# EAGLE design gondola (EAGLE 8.3.2)
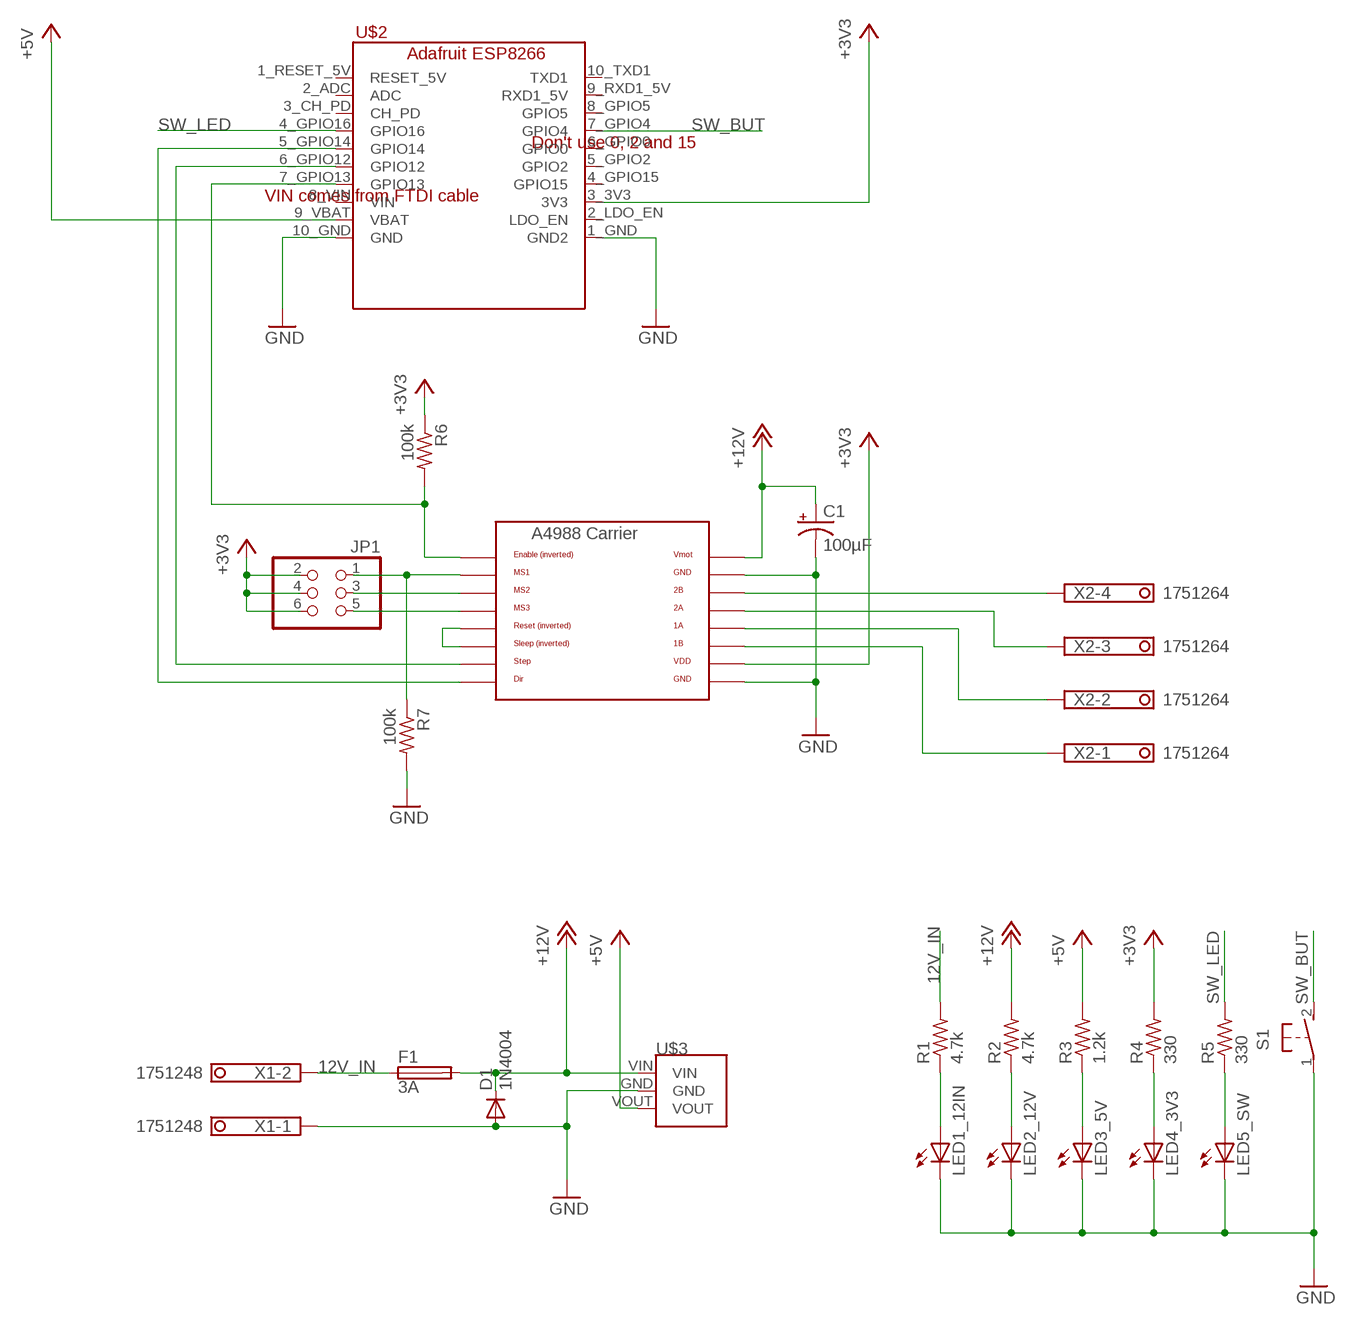
[diagram p0: schematic, sheet 1]

## Parts
C1  100µF  CPOL-US153CLV-0605  [153CLV-0605]
D1  1N4004  [DO41-10]
F1  3A  PTCFUSE  [LITTLEFUSE]
JP1  PINHD-2X3  [2X03]
LED1_12IN  LEDCHIP-LED0805  [CHIP-LED0805]
LED2_12V  LEDCHIP-LED0805  [CHIP-LED0805]
LED3_5V  LEDCHIP-LED0805  [CHIP-LED0805]
LED4_3V3  LEDCHIP-LED0805  [CHIP-LED0805]
LED5_SW  LEDCHIP-LED0805  [CHIP-LED0805]
R1  4.7k  R-US_R0805  [R0805]
R2  4.7k  R-US_R0805  [R0805]
R3  1.2k  R-US_R0805  [R0805]
R4  330  R-US_R0805  [R0805]
R5  330  R-US_R0805  [R0805]
R6  100k  R-US_R0805  [R0805]
R7  100k  R-US_R0805  [R0805]
S1  31-XX  [B3F-31XX]
U$1  A4988BREAKOUT  [A4988BREAKOUT]
U$2  ADAFRUIT_ESP8266  [ADAFRUIT_ESP8266]
U$3  ROHM_BP5293-XX  [ROHM_BP5293-XX]
X1  1751248  [1751248]
X2  1751264  [1751264]

## Nets
1A: U$1.1A X2.2
1B: U$1.1B X2.1
2A: U$1.2A X2.3
2B: U$1.2B X2.4
12V_IN: F1.1 R1.2 X1.2
!RESET: U$1.RST U$1.SLP(SLEEP)
+3V3: JP1.2 JP1.4 JP1.6 R4.2 R6.1 U$1.VDD U$2.3_3V3(3V3)
+5V: R3.2 U$2.9_VBAT(VBAT) U$3.VOUT
+12V: C1.+ D1.C F1.2 R2.2 U$1.VMOT U$3.VIN
DIR: U$1.DIR U$2.5_GPIO14(GPIO14)
GND: C1.- D1.A LED1_12IN.C LED2_12V.C LED3_5V.C LED4_3V3.C LED5_SW.C R7.2 S1.1(P) U$1.GND U$1.GND@0(GND) U$2.1_GND(GND2) U$2.10_GND(GND) U$3.GND X1.1
M_EN: R6.2 U$1.EN U$2.7_GPIO13(GPIO13)
MS1: JP1.1 R7.1 U$1.MS1
MS2: JP1.3 U$1.MS2
MS3: JP1.5 U$1.MS3
N$1: LED2_12V.A R2.1
N$2: LED1_12IN.A R1.1
N$8: LED4_3V3.A R4.1
N$18: LED5_SW.A R5.1
N$19: LED3_5V.A R3.1
STEP: U$1.STEP U$2.6_GPIO12(GPIO12)
SW_BUT: S1.2(S) U$2.7_GPIO4(GPIO4)
SW_LED: R5.2 U$2.4_GPIO16(GPIO16)
Unconnected: U$2.1_RESET_5V(RESET_5V) U$2.2_ADC(ADC) U$2.2_LDO_EN(LDO_EN) U$2.3_CH_PD(CH_PD) U$2.4_GPIO15(GPIO15) U$2.5_GPIO2(GPIO2) U$2.6_GPIO0(GPIO0) U$2.8_GPIO5(GPIO5) U$2.8_VIN(VIN) U$2.9_RXD1_5V(RXD1_5V) U$2.10_TXD1(TXD1)

## Notes on the sheet
- Don't use 0, 2 and 15
- VIN comes from FTDI cable

## Library data of the parts
C1 = adafruit:CPOL-US: POLARIZED CAPACITOR, American symbol
D1 = diode:1N4004: DIODE general purpose rectifier, 1 A
F1 = RepRapjr:PTCFUSE: LITTLEFUSE Picofuse/slow Littlefuse
JP1 = pinhead:PINHD-2X3: PIN HEADER
LED1_12IN LED2_12V LED3_5V LED4_3V3 LED5_SW = led:LED: LED OSRAM: - CHIPLED LG R971, LG N971, LY N971, LG Q971, LY Q971, LO R971, LY R971 LH N974, LH R974 LS Q976, LO Q976, LY Q976 LO Q996 - Hyper CHIPLED LW Q18S LB Q993, LB Q99A, LB R99A - SideLED LS A670, LO A670, LY A670, LG A670, LP A670 LB A673, LV A673, LT A673, LW A673 LH A674 LY A675 LS A676, LA A676, LO A676, LY A676, LW A676 LS A679, LY A679, LG A679 - Hyper Micro SIDELED® LS Y876, LA Y876, LO Y876, LY Y876 LT Y87S - SmartLED LW L88C, LW L88S LB L89C, LB L89S, LG L890 LS L89K, LO L89K, LY L89K LS L896, LA L896, LO L896, LY L896 - TOPLED LS T670, LO T670, LY T670, LG T670, LP T670 LSG T670, LSP T670, LSY T670, LOP T670, LYG T670 LG T671, LOG T671, LSG T671 LB T673, LV T673, LT T673, LW T673 LH T674 LS T676, LA T676, LO T676, LY T676, LB T676, LH T676, LSB T676, LW T676 LB T67C, LV T67C, LT T67C, LS T67K, LO T67K, LY T67K, LW E67C LS E67B, LA E67B, LO E67B, LY E67B, LB E67C, LV E67C, LT E67C LW T67C LS T679, LY T679, LG T679 LS T770, LO T770, LY T770, LG T770, LP T770 LB T773, LV T773, LT T773, LW T773 LH T774 LS E675, LA E675, LY E675, LS T675 LS T776, LA T776, LO T776, LY T776, LB T776 LHGB T686 LT T68C, LB T68C - Hyper Mini TOPLED® LB M676 - Mini TOPLED Santana® LG M470 LS M47K, LO M47K, LY M47K Source: http://www.osram.convergy.de LUXEON: - LUMILED® LXK2-PW12-R00, LXK2-PW12-S00, LXK2-PW14-U00, LXK2-PW14-V00 LXK2-PM12-R00, LXK2-PM12-S00, LXK2-PM14-U00 LXK2-PE12-Q00, LXK2-PE12-R00, LXK2-PE12-S00, LXK2-PE14-T00, LXK2-PE14-U00 LXK2-PB12-K00, LXK2-PB12-L00, LXK2-PB12-M00, LXK2-PB14-N00, LXK2-PB14-P00, LXK2-PB14-Q00 LXK2-PR12-L00, LXK2-PR12-M00, LXK2-PR14-Q00, LXK2-PR14-R00 LXK2-PD12-Q00, LXK2-PD12-R00, LXK2-PD12-S00 LXK2-PH12-R00, LXK2-PH12-S00 LXK2-PL12-P00, LXK2-PL12-Q00, LXK2-PL12-R00 Source: www.luxeon.com KINGBRIGHT: KA-3528ASYC Source: www.kingbright.com
R1-R7 = adafruit:R-US_: RESISTOR, American symbol
S1 = switch-omron:31-XX: OMRON SWITCH; MPN: B3F-3100; OC_FARNELL: 959704; OC_NEWARK: 36M3582
U$1 = RepRapjr:A4988BREAKOUT
U$2 = MS:ADAFRUIT_ESP8266
U$3 = MS:ROHM_BP5293-XX
X1 = con-phoenix-350:1751248: MKDS 1/ 2-3,5 Printklemme Nennstrom: 10 A Bemessungsspannung: 160 V Raster: 3,5 mm Polzahl: 2 Montageart: Löten Anschlussart: Schraubanschluss Anschlussrichtung vom Leiter zur Platine: 0° Source: http://eshop.phoenixcontact.com .. 1751248.pdf; OC_FARNELL: unknown; OC_NEWARK: unknown
X2 = con-phoenix-350:1751264: MKDS 1/ 4-3,5 Printklemme Nennstrom: 10 A Bemessungsspannung: 160 V Raster: 3,5 mm Polzahl: 4 Montageart: Löten Anschlussart: Schraubanschluss Anschlussrichtung vom Leiter zur Platine: 0° Source: http://eshop.phoenixcontact.com .. 1751264.pdf; MPN: 1751264; OC_FARNELL: unknown; OC_NEWARK: 10R0934

## Board
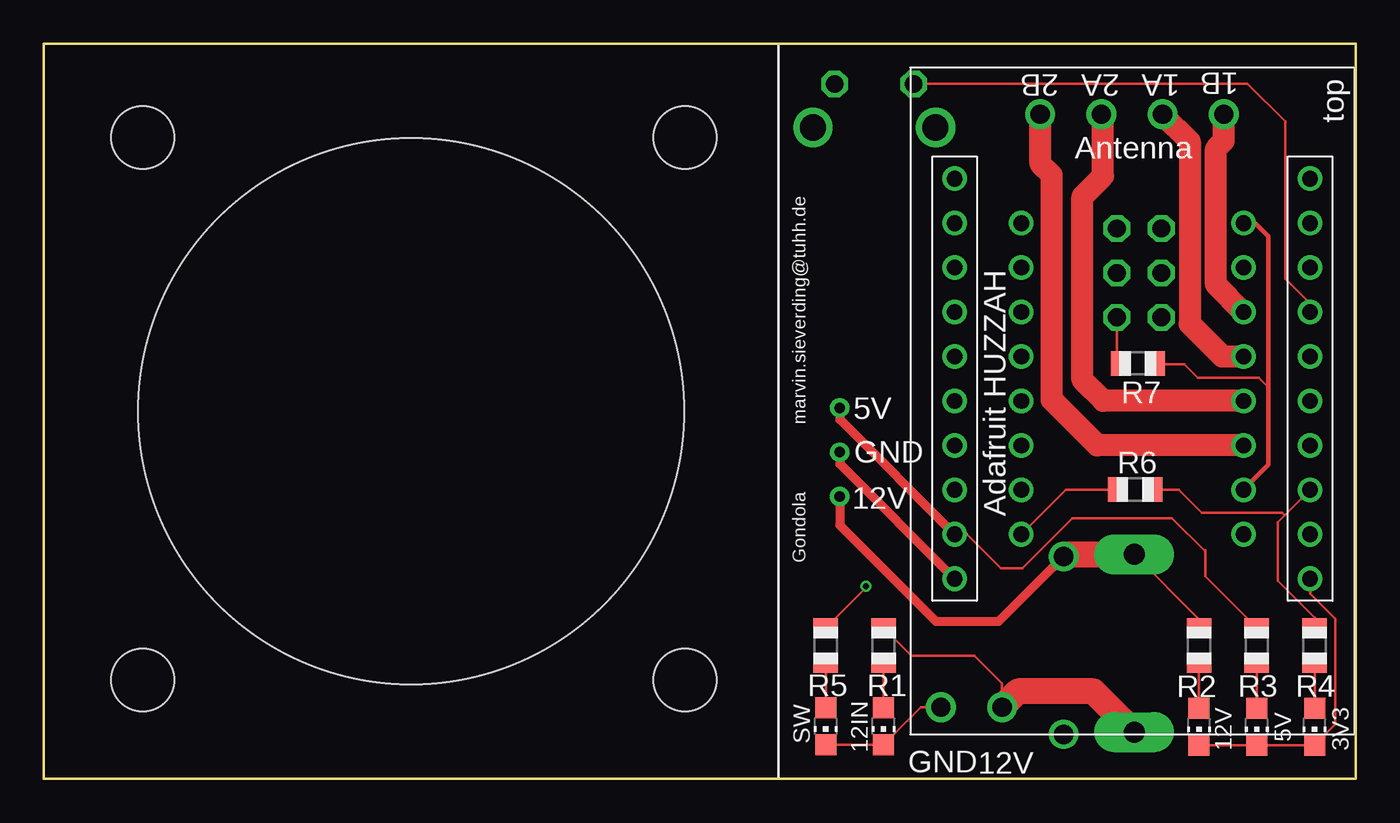
[diagram p1: board, top side]
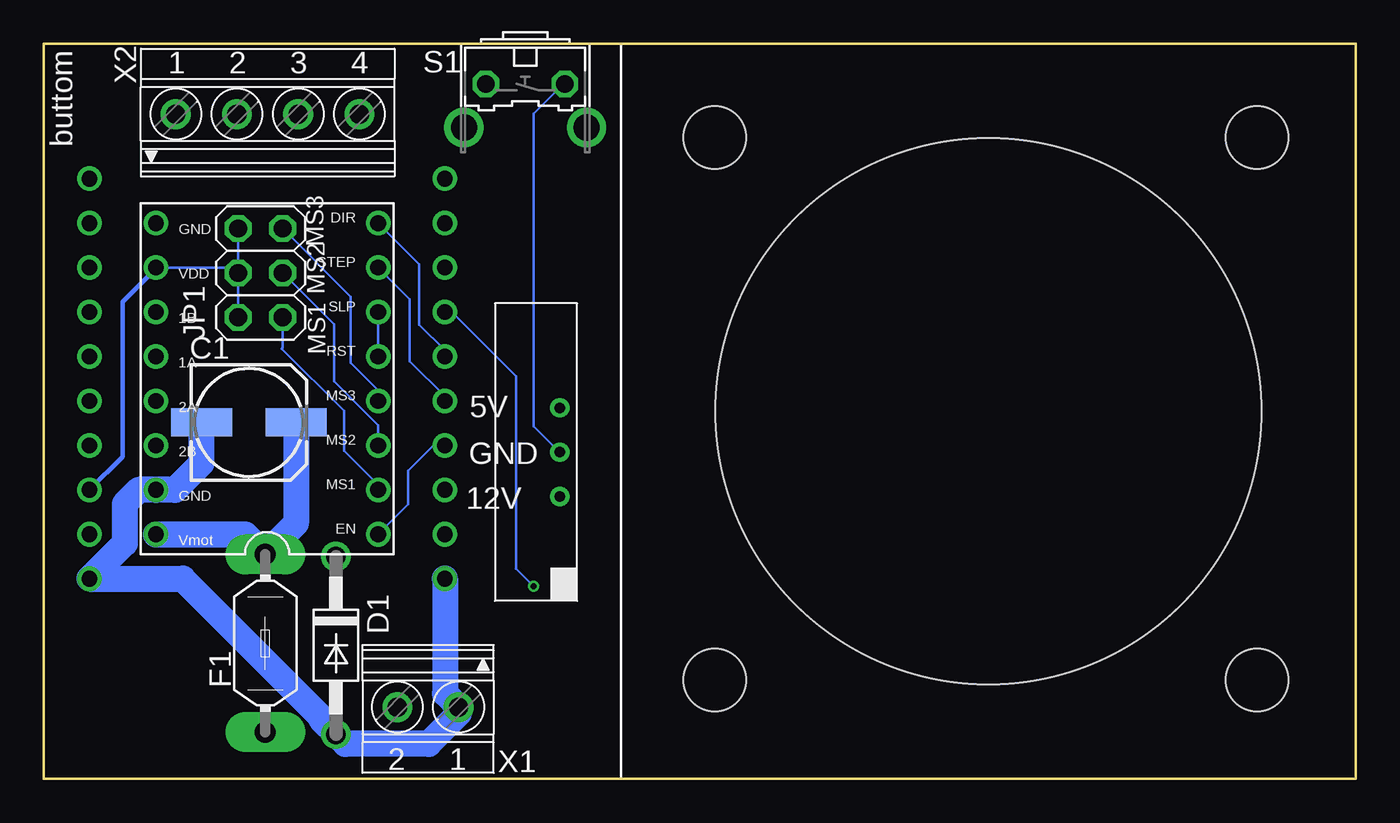
[diagram p2: board, bottom side, seen from below]

Size 75 x 42 mm. Coordinates in mm from the lower left corner, seen from the top.
Outline: 0,0 0,42 75,42 75,0 0,0
Copper layers (1*16): Top 0.035mm / dielectric 1.5mm / Bottom 0.035mm
Design rules "dirt_cheap_dirty_boards.v1": minimum track width 5mil, minimum drill 12mil, track to track 5mil, track to pad 5mil, pad to pad 5mil, via to via 5mil, smd to smd 0mil, copper to edge 10mil, drill to drill 10mil, minimum pad ring 10mil, minimum via ring 6mil, stop-mask expansion 2mil, vias tented up to drill 25mil, thermal gap 10mil
Holes 3.6 mm at 5.65,5.65 36.65,36.65 5.65,36.65 36.65,5.65
Holes 31.2 mm at 21,21

### Footprints (pad centres in the part's own frame; a part is rotated, then mirrored left to right if it is on the bottom)
153CLV-0605 = smd 3.5 x 1.6: + 2.7,0; - -2.7,0
DO41-10 = drill 1.118: A 5.08,0; C -5.08,0
LITTLEFUSE = drill 1.2 pad 2.3 long: 1 -5.08,0; 2 5.08,0
2X03 = drill 1.016 octagon: 1 -2.54,-1.27; 2 -2.54,1.27; 3 0,-1.27; 4 0,1.27; 5 2.54,-1.27; 6 2.54,1.27
CHIP-LED0805 = smd 1.2 x 1.2: A 0,-1.05; C 0,1.05
R0805 = smd 1.1 x 1.4: 1 -1,0; 2 1,0
B3F-31XX = drill 1.016 octagon: 1 -2.261,-1.245; 2 2.261,-1.245 | drill 1.499 pad 2.159: 3 -3.505,1.245; 4 3.505,1.245
A4988BREAKOUT = drill 0.9: 1A 8.89,1.27; 1B 11.43,1.27; 2A 6.35,1.27; 2B 3.81,1.27; DIR 16.51,-11.43; EN -1.27,-11.43; GND 16.51,1.27; GND@0 1.27,1.27; MS1 1.27,-11.43; MS2 3.81,-11.43; MS3 6.35,-11.43; RST 8.89,-11.43; SLP 11.43,-11.43; STEP 13.97,-11.43; VDD 13.97,1.27; VMOT -1.27,1.27
ADAFRUIT_ESP8266 = drill 0.9: 1_GND 22.86,8.89; 1_RESET_5V 2.54,31.75; 2_ADC 2.54,29.21; 2_LDO_EN 22.86,11.43; 3_3V3 22.86,13.97; 3_CH_PD 2.54,26.67; 4_GPIO15 22.86,16.51; 4_GPIO16 2.54,24.13; 5_GPIO2 22.86,19.05; 5_GPIO14 2.54,21.59; 6_GPIO0 22.86,21.59; 6_GPIO12 2.54,19.05; 7_GPIO4 22.86,24.13; 7_GPIO13 2.54,16.51; 8_GPIO5 22.86,26.67; 8_VIN 2.54,13.97; 9_RXD1_5V 22.86,29.21; 9_VBAT 2.54,11.43; 10_GND 2.54,8.89; 10_TXD1 22.86,31.75
ROHM_BP5293-XX = drill 0.6: GND 0,-2.54; VIN -2.54,-2.54; VOUT 2.54,-2.54
1751248 = drill 1.1 pad 1.7: 1 -1.75,-0.1; 2 1.75,-0.1
1751264 = drill 1.1 pad 1.7: 1 -5.25,-0.1; 2 -1.75,-0.1; 3 1.75,-0.1; 4 5.25,-0.1

### Placement (x,y rotation side)
C1  63.27,20.36 0 bottom
D1  58.29,7.62 270 bottom
F1  62.33,7.75 90 bottom
JP1  62.61,28.9 90 bottom
LED1_12IN  48.01,3 180 top
LED2_12V  66.04,2.97 180 top
LED3_5V  69.34,2.97 180 top
LED4_3V3  72.64,2.97 180 top
LED5_SW  44.7,3 180 top
R1  48.01,7.62 90 top
R2  66.04,7.62 90 top
R3  69.34,7.62 90 top
R4  72.64,7.62 90 top
R5  44.7,7.62 90 top
R6  62.39,16.53 180 top
R7  62.55,23.74 0 top
S1  47.47,38.46 180 bottom
U$1  67.31,15.24 90 bottom
U$2  49.53,2.54 0 top
U$3  48.05,18.66 90 bottom
X1  53.04,3.99 180 bottom
X2  62.2,38.07 0 bottom

### Tracks (layer width: path | path; a pad name or v marks a point on that pad's centre or on a via)
1A
  Top 1.27: X2.2 65.5,36.43 65.5,26 67.37,24.13 U$1.1A
1B
  Top 1.27: U$1.1B 67,28.25 67,36 67.45,36.45 X2.1
2A
  Top 0.152: 68.56,21.59 U$1.2A
  Top 1.27: U$1.2A 60.57,21.59 59.38,22.78 59.38,33.27 60.55,34.44 60.55,37.88 X2.3
2B
  Top 1.27: U$1.2B 60.22,19.05 57.62,21.65 57.62,34.49 56.98,35.13 56.98,37.95 X2.4
12V_IN
  Top 0.152: R1.2 49.59,7.04 53.21,7.04 54.78,5.46 X1.2
  Top 1.499: F1.1 60,5 55.7,5 X1.2
!RESET
  Bottom 0.152: U$1.RST U$1.SLP 55.88,27.08
+3V3
  Top 0.152: R4.2 72.64,9.2 70.54,11.3 70.54,14.66 70.94,15.06 | 70.94,15.06 U$2.3_3V3 | 70.94,15.06 70.8,15.2 66.2,15.2 64.87,16.53 R6.1
  Bottom 0.152: JP1.4 JP1.2 | JP1.6 JP1.4 | U$1.VDD 64.19,29.21 JP1.4
  Bottom 0.254: U$1.VDD 68.58,29.17 70.5,27.25 70.5,18.4 U$2.3_3V3
+5V
  Top 0.152: 66.4,13 66.4,13.06 | 66.4,13 66.4,11.57 R3.2 | U$2.9_VBAT 52.78,13.97 54.71,12.04 55.94,12.04 58.8,14.9 64.5,14.9 66.4,13
  Top 0.508: U$3.VOUT 45.51,20.53 U$2.9_VBAT
+12V
  Top 0.152: F1.2 66.04,9.12 R2.2
  Top 0.508: U$3.VIN 45.51,14.49 51,9 54.59,9 D1.C
  Top 1.27: D1.C 58.42,12.83
  Top 1.499: 58.42,12.83 F1.2
  Bottom 1.499: U$1.VMOT 63.48,13.97 F1.2 60.57,14.59 C1.+
DIR
  Bottom 0.152: U$2.5_GPIO14 52.07,24.48 53.54,25.95 53.54,29.41 U$1.DIR
GND
  Top 0.152: U$2.1_GND 72.39,10.59 73.83,9.14 73.83,3.11 LED4_3V3.C LED3_5V.C LED2_12V.C | LED5_SW.C LED1_12IN.C 50.15,4.09 X1.1 | 70,22.38 69.46,22.92 65.98,22.92 65.2,23.7 63.59,23.7 R7.2
  Top 0.254: U$1.GND 69.25,31.75 70,31 70,22.38 70,17.93 U$1.GND@0
  Top 0.508: U$3.GND 45.51,17.99 U$2.10_GND
  Bottom 0.152: S1.1 45.3,39.7 47,38 47,20.15 U$3.GND
  Bottom 1.499: U$2.10_GND 52.07,4.87 X1.1 51.28,3.71 53,2 57.75,2 D1.A 59.13,3.38 59.13,3.52 67.04,11.43 U$2.1_GND 70.37,13.45 70.37,15.71 69.57,16.51 U$1.GND@0 67.49,16.51 65.97,18.03 C1.-
M_EN
  Top 0.152: R6.2 58.44,16.53 U$1.EN
  Bottom 0.152: U$2.7_GPIO13 52.7,19.05 54.16,17.59 54.16,15.69 U$1.EN
MS1
  Top 0.152: 61.34,23.27 R7.1 61.34,23.95 JP1.1
  Bottom 0.152: U$1.MS1 55.88,16.79 57.82,18.73 57.82,21.02 61.39,24.59 61.34,24.64 JP1.1 61.39,26.31
MS2
  Bottom 0.152: U$1.MS2 55.88,20.2 58.4,22.71 58.4,25.96 JP1.3
MS3
  Bottom 0.152: U$1.MS3 55.88,22.2 57.45,23.77 57.45,27.55 JP1.5
N$1
  Top 0.152: R2.1 LED2_12V.A
N$2
  Top 0.152: R1.1 LED1_12IN.A
N$8
  Top 0.152: R4.1 LED4_3V3.A
N$18
  Top 0.152: R5.1 LED5_SW.A
N$19
  Top 0.152: R3.1 LED3_5V.A
STEP
  Bottom 0.152: U$2.6_GPIO12 52.07,21.85 54.08,23.85 54.08,27.41 U$1.STEP
SW_BUT
  Top 0.152: S1.2 49.76,39.73 68.81,39.73 70.97,37.57 70.97,28.57 72.39,27.15 U$2.7_GPIO4
SW_LED  (via drill 0.35)
  Top 0.152: v47,11 47,10.92 R5.2
  Bottom 0.152: U$2.4_GPIO16 51.67,26.67 48,23 48,12 v47,11

### Text on the board
tPlace: 2B | 2A | 1A | 1B | top | marvin.sieverding@tuhh.de | 5V | GND | Gondola | 12V | SW | 12IN | 12V | 5V | 3V3 | GND | 12V
bPlace: buttom | MS3 | MS2 | MS1 | 5V | GND | 12V